# EAGLE schematic P8-I2C_Communication_AC (EAGLE 9.6.2)
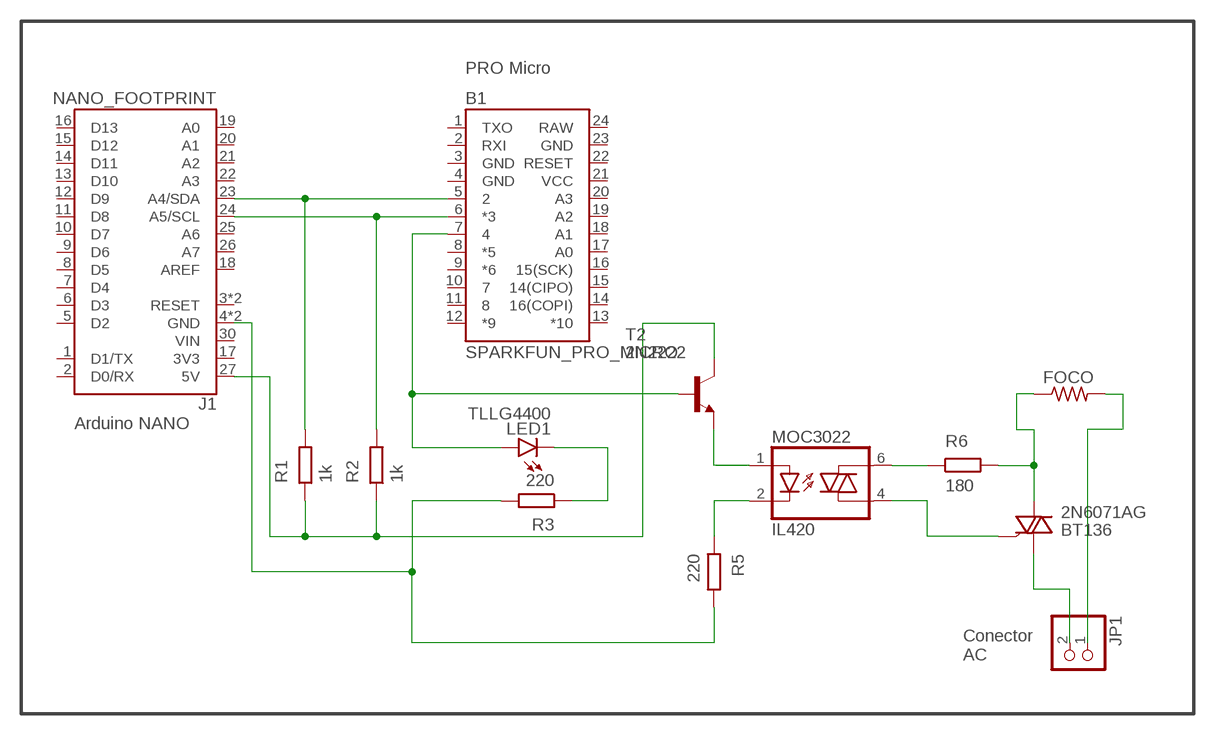
[diagram p0: schematic, sheet 1]

## Parts
2N6071AG  BT136  [TO220AB]
B1  SPARKFUN_PRO_MICRO  [SPARKFUN_PRO_MICRO]
FOCO  R-US_0204/2V  [0204V]
J1  NANO_FOOTPRINT  [NANO]
JP1  PINHD-1X2/90  [1X02/90]
LED1  TLLG4400  [LED3MM]
MOC3022  IL420  [DIL06]
R1  1k  R  (no package)
R2  1k  R  (no package)
R3  220  R  (no package)
R5  220  R  (no package)
R6  180  R  (no package)
T2  2N2222  [TO18]

## Nets
N$1: B1.5 J1.23(A4/SDA) R1.2
N$2: B1.6(*3) J1.24(A5/SCL) R2.2
N$3: J1.27(5V) R1.1 R2.1 T2.3(C)
N$4: B1.7 LED1.A T2.2(B)
N$5: LED1.K(C) R3.1
N$6: J1.4(GND) J1.29(GND) R3.2 R5.2
N$7: MOC3022.1(A) T2.1(E)
N$8: 2N6071AG.3(G) MOC3022.4(A1)
N$9: MOC3022.2(C) R5.1
N$10: MOC3022.6(A2) R6.1
N$11: 2N6071AG.2(A2) FOCO.1 R6.2
N$12: 2N6071AG.1(A1) JP1.2
N$14: FOCO.2 JP1.1
Unconnected: B1.1(TXO) B1.2(RXI) B1.8(*5) B1.9(*6) B1.10 B1.11 B1.12(*9) B1.13(*10) B1.14(16(COPI)) B1.15(14(CIPO)) B1.16(15(SCK)) B1.17(A0) B1.18(A1) B1.19(A2) B1.20(A3) B1.22(RESET) J1.1(D1/TX) J1.2(D0/RX) J1.3(RESET) J1.5(D2) J1.6(D3) J1.7(D4) J1.8(D5) J1.9(D6) J1.10(D7) J1.11(D8) J1.12(D9) J1.13(D10) J1.14(D11) J1.15(D12) J1.16(D13) J1.17(3V3) J1.18(AREF) J1.19(A0) J1.20(A1) J1.21(A2) J1.22(A3) J1.25(A6) J1.26(A7) J1.28(RESET) J1.30(VIN)

## Notes on the sheet
- PRO Micro
- Arduino NANO
- Conector
  AC

## Power pins joined to a net without a drawn wire
GND: B1.3(GND) B1.4(GND) B1.23(GND)
RAW: B1.24(RAW)
VCC: B1.21(VCC)

## Library data of the parts
2N6071AG = triac:BT136: Triac BT136 series E sensitive gate Source: http://www.nxp.com/acrobat_download/datasheets/BT136_SERIES_E_2.pdf
B1 = SparkFun-Boards:SPARKFUN_PRO_MICRO: SparkFun Pro Micro Atmega32U4 compatible footprint. SparkFun Products: 3.3V/8MHz <https://www.sparkfun.com/products/12587> 5V/16MHz <https://www.sparkfun.com/products/12640>
FOCO = rcl:R-US_: RESISTOR, American symbol; SPICEPREFIX: R
J1 = SparkFun-Boards:NANO_FOOTPRINT: Generic Nano Footprint
JP1 = pinhead:PINHD-1X2: PIN HEADER
LED1 = led:TLLG4400: Low Current (2mA) LED 3 mm Tinted Diffused Package color GREEN Source: Data sheet <http://www.farnell.com/datasheets/391098.pdf>; MF: VISHAY SEMICONDUCTOR; OC_FARNELL: 1612435
MOC3022 = optocoupler:IL420: SIEMENS OPTO COUPLER; MF: VISHAY/TELEFUNKEN; MPN: IL420; OC_FARNELL: 1469561; OC_NEWARK: 58K1719
R1-R3 R5 R6 = ngspice-simulation:R: RESISTOR
T2 = transistor:2N2222: NPN TRANSISTOR